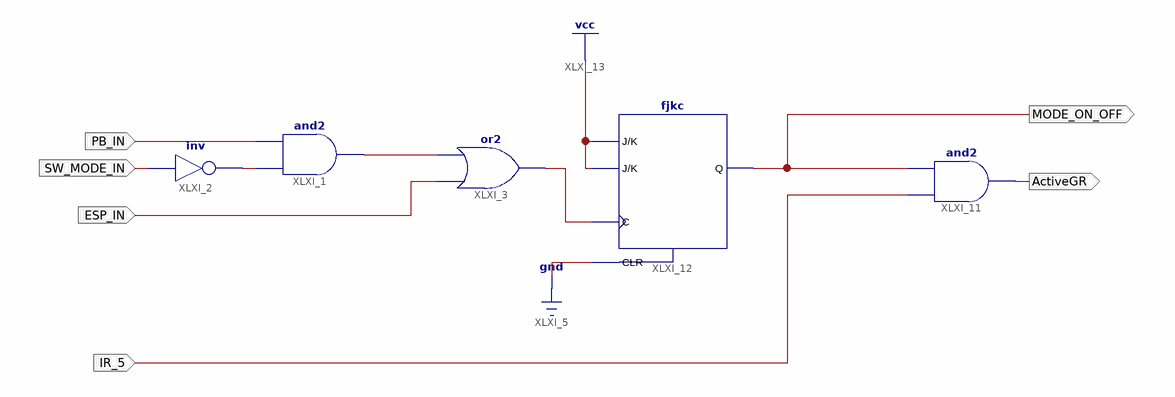
[diagram p0: schematic sheet 1]
// Xilinx ISE schematic Alarm_Garage_V5.sch (spartan6) as structural Verilog: 5 symbols, 6 ports
module Alarm_Garage_V5 (
  input  PB_IN,
  input  SW_MODE_IN,
  input  ESP_IN,
  input  IR_5,
  output MODE_ON_OFF,
  output ActiveGR
);

  wire XLXN_1, XLXN_4, XLXN_14;

  and XLXI_1 (XLXN_4, XLXN_1, PB_IN);
  not XLXI_2 (XLXN_1, SW_MODE_IN);
  or XLXI_3 (XLXN_14, ESP_IN, XLXN_4);
  and XLXI_11 (ActiveGR, IR_5, MODE_ON_OFF);
  fjkc XLXI_12 (.C(XLXN_14), .CLR(1'b0), .J(1'b1), .K(1'b1), .Q(MODE_ON_OFF));
endmodule
